# Altium schematic sheet 03.Block_Diagram.SchDoc: CM3 IO
size 500 x 350 mm; Page Create Date: March  8, 1995; Page Number: 03; Page Size: Custom; Comment: radxa_1010; Page Count: 20; RevCode: 1.36; Doc: Block_Diagram; DsnPath: D:\WMS\黄工\[RC119]CM3_IO_V1.36\对外资料\radxa_cm3_io_board_v1360.DSN; SchematicName: CM3_IO V1.36; PageName: 03.Block_Diagram; PageSize: Custom; TopSchematic: True
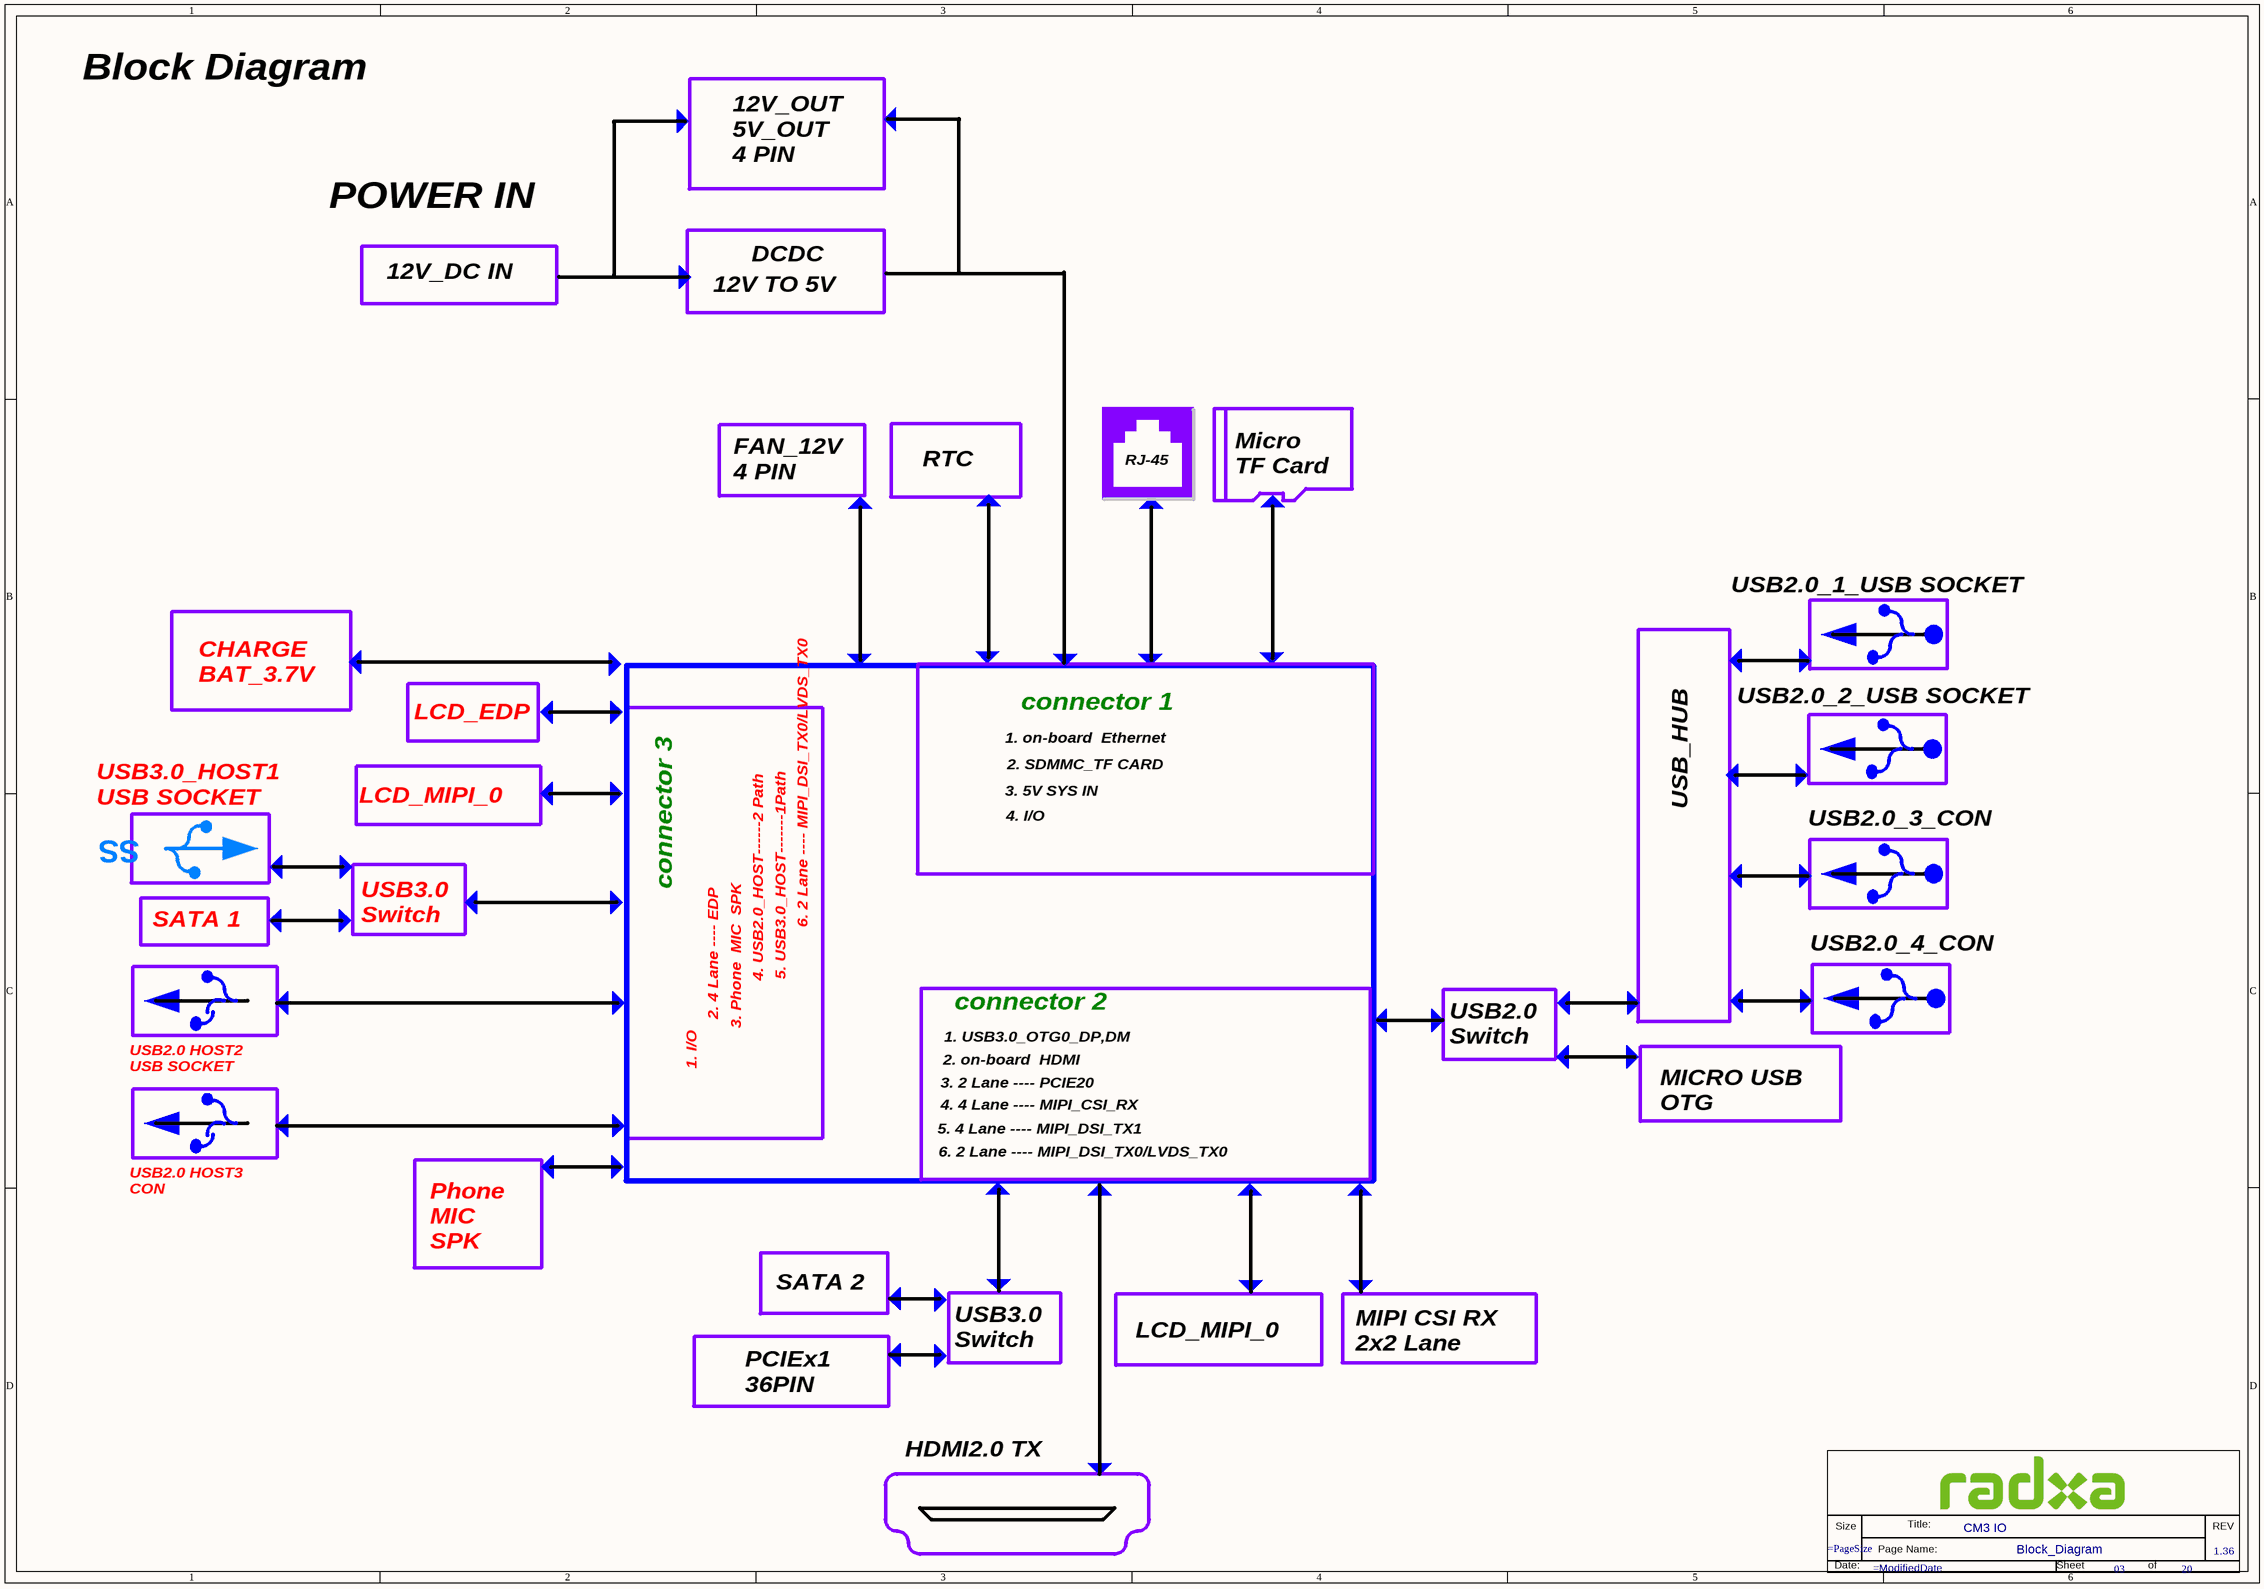
[diagram p0: 03.Block_Diagram.SchDoc]

## Parts
*  Doc: Block_Diagram  RevCode: 1.36  Title: CM3 IO  Page Number: 03  Page Count: 20  (hidden comment: radxa_1010)  (graphical)

## Notes on the sheet
- Block Diagram
- 12V_OUT
  5V_OUT
  4 PIN
- POWER IN
- 12V_DC IN
- DCDC
- 12V TO 5V
- FAN_12V
  4 PIN
- Micro
  TF Card
- RTC
- RJ-45
- CHARGE
  BAT_3.7V
- USB2.0_1_USB SOCKET
- LCD_EDP
- 1. on-board  Ethernet
- connector 1
- USB2.0_2_USB SOCKET
- USB3.0_HOST1
  USB SOCKET
- LCD_MIPI_0
- 3. 5V SYS IN
- 2. SDMMC_TF CARD
- USB_HUB
- SS
- 4. I/O
- USB2.0_3_CON
- USB3.0
  Switch
- connector 3
- SATA 1
- 5. USB3.0_HOST-------1Path
- 6. 2 Lane ---- MIPI_DSI_TX0/LVDS_TX0
- USB2.0_4_CON
- 2. 4 Lane ---- EDP
- 3. Phone  MIC  SPK
- 4. USB2.0_HOST------2 Path
- connector 2
- USB2.0
  Switch
- USB2.0 HOST2
  USB SOCKET
- 1. I/O
- 3. 2 Lane ---- PCIE20
- 2. on-board  HDMI
- 1. USB3.0_OTG0_DP,DM
- MICRO USB
  OTG
- 5. 4 Lane ---- MIPI_DSI_TX1
- 4. 4 Lane ---- MIPI_CSI_RX
- USB2.0 HOST3
  CON
- Phone
  MIC
  SPK
- SATA 2
- MIPI CSI RX
  2x2 Lane
- PCIEx1
  36PIN
- HDMI2.0 TX
- (in symbol radxa_1010) Size; Title:; REV; Page Name:; Date:; Sheet; of

## Library data of the parts
* = radxa_1010: Page Create Date: March  8, 1995; Page Size: =PageSize; Page Modify Date: =ModifiedDate